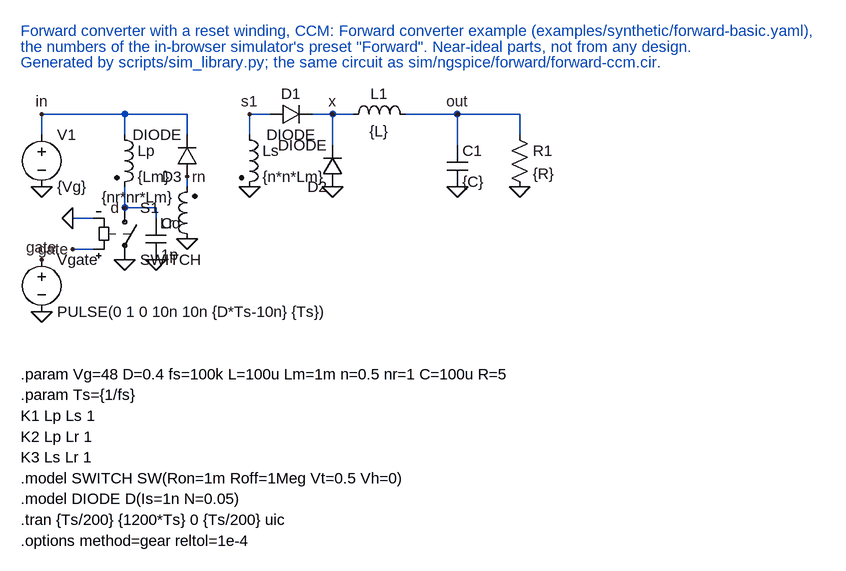
[diagram p0: schematic forward-ccm.asc]
forward-ccm.asc, the LTspice schematic file:
Version 4
SHEET 1 896 944
WIRE 0 64 0 96
WIRE 0 64 128 64
WIRE 128 64 128 96
WIRE 128 64 224 64
WIRE 224 64 224 96
WIRE 80 272 48 272
WIRE 80 224 48 224
WIRE 128 176 128 208
WIRE 128 208 176 208
WIRE 176 208 176 224
WIRE 224 160 224 176
WIRE 320 96 320 64
WIRE 320 64 352 64
WIRE 416 64 448 64
WIRE 448 64 448 112
WIRE 448 64 480 64
WIRE 560 64 640 64
WIRE 640 64 640 112
WIRE 640 64 736 64
WIRE 736 64 736 96
FLAG 0 64 in
FLAG 0 176 0
FLAG 0 288 gate
FLAG 0 368 0
FLAG 48 272 gate
FLAG 48 224 0
FLAG 128 288 0
FLAG 176 288 0
FLAG 128 208 d
FLAG 224 256 0
FLAG 224 160 rn
FLAG 320 176 0
FLAG 320 64 s1
FLAG 448 176 0
FLAG 448 64 x
FLAG 640 176 0
FLAG 736 176 0
FLAG 640 64 out
SYMBOL voltage 0 80 R0
SYMATTR InstName V1
SYMATTR Value {Vg}
SYMBOL voltage 0 272 R0
SYMATTR InstName Vgate
SYMATTR Value PULSE(0 1 0 10n 10n {D*Ts-10n} {Ts})
SYMBOL ind2 112 80 R0
SYMATTR InstName Lp
SYMATTR Value {Lm}
SYMBOL sw 128 192 R0
SYMATTR InstName S1
SYMATTR Value SWITCH
SYMBOL cap 160 224 R0
SYMATTR InstName Cd
SYMATTR Value 1p
SYMBOL diode 240 160 R180
SYMATTR InstName D3
SYMATTR Value DIODE
SYMBOL ind2 240 272 R180
SYMATTR InstName Lr
SYMATTR Value {nr*nr*Lm}
SYMBOL ind2 304 80 R0
SYMATTR InstName Ls
SYMATTR Value {n*n*Lm}
SYMBOL diode 352 80 R270
WINDOW 0 32 32 VTop 2
WINDOW 3 0 32 VBottom 2
SYMATTR InstName D1
SYMATTR Value DIODE
SYMBOL diode 464 176 R180
SYMATTR InstName D2
SYMATTR Value DIODE
SYMBOL ind 464 80 R270
WINDOW 0 32 56 VTop 2
WINDOW 3 5 56 VBottom 2
SYMATTR InstName L1
SYMATTR Value {L}
SYMBOL cap 624 112 R0
SYMATTR InstName C1
SYMATTR Value {C}
SYMBOL res 720 80 R0
SYMATTR InstName R1
SYMATTR Value {R}
TEXT -32 -64 Left 2 ;Forward converter with a reset winding, CCM: Forward converter example (examples/synthetic/forward-basic.yaml),
TEXT -32 -40 Left 2 ;the numbers of the in-browser simulator's preset "Forward". Near-ideal parts, not from any design.
TEXT -32 -16 Left 2 ;Generated by scripts/sim_library.py; the same circuit as sim/ngspice/forward/forward-ccm.cir.
TEXT -32 464 Left 2 !.param Vg=48 D=0.4 fs=100k L=100u Lm=1m n=0.5 nr=1 C=100u R=5
TEXT -32 496 Left 2 !.param Ts={1/fs}
TEXT -32 528 Left 2 !K1 Lp Ls 1
TEXT -32 560 Left 2 !K2 Lp Lr 1
TEXT -32 592 Left 2 !K3 Ls Lr 1
TEXT -32 624 Left 2 !.model SWITCH SW(Ron=1m Roff=1Meg Vt=0.5 Vh=0)
TEXT -32 656 Left 2 !.model DIODE D(Is=1n N=0.05)
TEXT -32 688 Left 2 !.tran {Ts/200} {1200*Ts} 0 {Ts/200} uic
TEXT -32 720 Left 2 !.options method=gear reltol=1e-4

The netlist it stands for:
* forward-ccm.asc
V1 in 0 {Vg}
Vgate gate 0 PULSE(0 1 0 10n 10n {D*Ts-10n} {Ts})
Lp in d {Lm}
S1 d 0 gate 0 SWITCH
Cd d 0 1p
D3 rn in DIODE
Lr 0 rn {nr*nr*Lm}
Ls s1 0 {n*n*Lm}
D1 s1 x DIODE
D2 0 x DIODE
L1 x out {L}
C1 out 0 {C}
R1 out 0 {R}
.model D D
.lib standard.dio
* Forward converter with a reset winding, CCM: Forward converter example (examples/synthetic/forward-basic.yaml),
* the numbers of the in-browser simulator's preset "Forward". Near-ideal parts, not from any design.
* Generated by scripts/sim_library.py; the same circuit as sim/ngspice/forward/forward-ccm.cir.
.param Vg=48 D=0.4 fs=100k L=100u Lm=1m n=0.5 nr=1 C=100u R=5
.param Ts={1/fs}
K1 Lp Ls 1
K2 Lp Lr 1
K3 Ls Lr 1
.model SWITCH SW(Ron=1m Roff=1Meg Vt=0.5 Vh=0)
.model DIODE D(Is=1n N=0.05)
.tran {Ts/200} {1200*Ts} 0 {Ts/200} uic
.options method=gear reltol=1e-4
.backanno
.end